# EasyEDA Pro project 步进电机天猛星转接板.eprj, schematic Schematic2
Board Name: Board2; Create Date: 2025-07-24; Page Name: P1; Project Name: 步进电机天空星转接板; Schematic Name: Schematic2; Update Date: 2025-07-24; Company: 嘉立创EDA; Page Size: A4; Version: V1.0
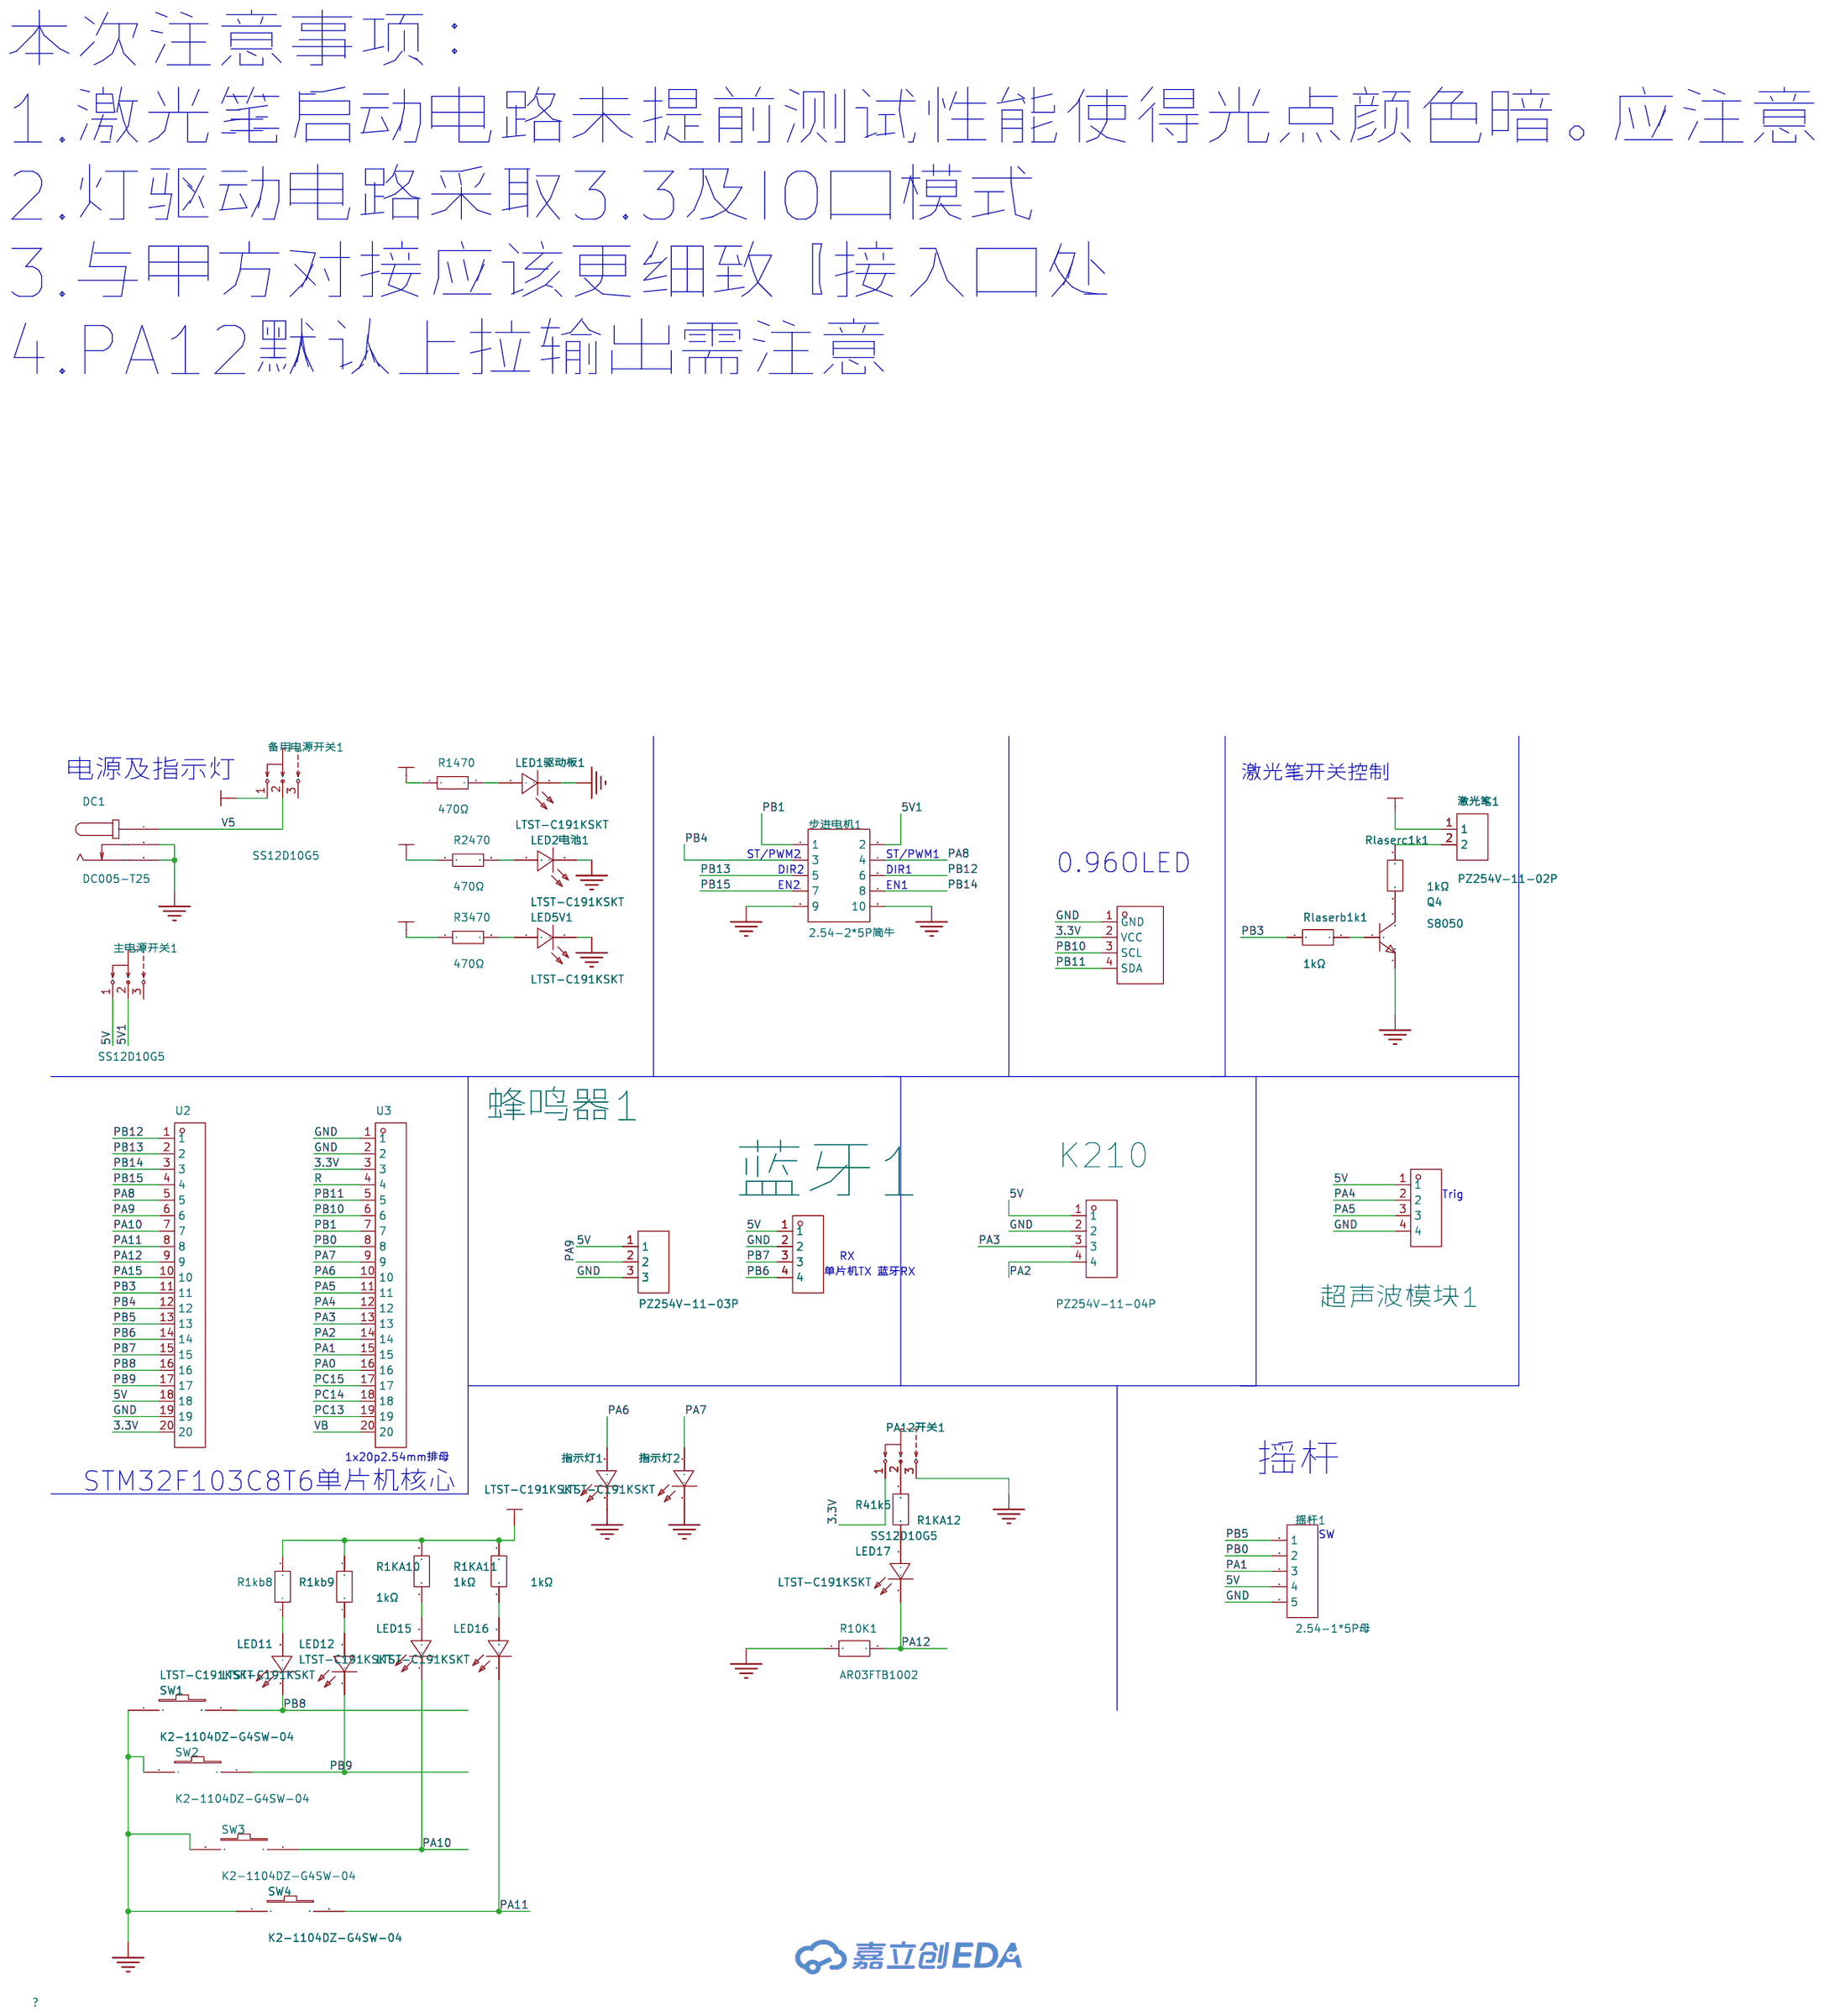
[diagram p1: schematic sheet]

## Parts
DC1  DC005-T25  [DC-IN-TH_DC-005-20A-1]
K210  PZ254V-11-04P  [HDR-TH_4P-P2.54-V-M]
LED1驱动板1  LTST-C191KSKT  [LED0603-RD-YELLOW]
LED2电池1  LTST-C191KSKT  [LED0603-RD-YELLOW]
LED5V1  LTST-C191KSKT  [LED0603-RD-YELLOW]
LED11  LTST-C191KSKT  [LED0603-RD-YELLOW]
LED12  LTST-C191KSKT  [LED0603-RD-YELLOW]
LED15  LTST-C191KSKT  [LED0603-RD-YELLOW]
LED16  LTST-C191KSKT  [LED0603-RD-YELLOW]
LED17  LTST-C191KSKT  [LED0603-RD-YELLOW]
OLED1  HS96L03W2C03  [OLED-TH_L27.8-W27.2-P2.54_C9900033791]
PA12开关1  SS12D10G5  [SW-TH_SHOU-HAN_SS12D10G4]
Q4  S8050  [SOT-23-3_L2.9-W1.6-P1.90-LS2.8-BR]
R1KA10  1kΩ  [R0603]
R1KA11  1kΩ  [R0603]
R1kb8  1kΩ  [R0603]
R1kb9  1kΩ  [R0603]
R10K1  AR03FTB1002  [R0603]
R41k5  1kΩ  [R0603]
R1470  470Ω  [R0603]
R2470  470Ω  [R0603]
R3470  470Ω  [R0603]
Rlaserb1k1  1kΩ  [R0603]
Rlaserc1k1  1kΩ  [R0603]
SW1  K2-1104DZ-G4SW-04  [KEY-TH_2P-L6.0-W6.0-P5.00]
SW2  K2-1104DZ-G4SW-04  [KEY-TH_2P-L6.0-W6.0-P5.00]
SW3  K2-1104DZ-G4SW-04  [KEY-TH_2P-L6.0-W6.0-P5.00]
SW4  K2-1104DZ-G4SW-04  [KEY-TH_2P-L6.0-W6.0-P5.00]
U2  KH-2FH-1X20P-H4.3  [hdr-th_20p-p2.54-v-f]
U3  KH-2FH-1X20P-H4.3  [hdr-th_20p-p2.54-v-f]
主电源开关1  SS12D10G5  [SW-TH_SHOU-HAN_SS12D10G4]
备用电源开关1  SS12D10G5  [SW-TH_SHOU-HAN_SS12D10G4]
指示灯1  LTST-C191KSKT  [LED0603-RD-YELLOW]
指示灯2  LTST-C191KSKT  [LED0603-RD-YELLOW]
摇杆1  2.54-1*5P母  [HDR-TH_5P-P2.54-V-F]
步进电机1  2.54-2*5P简牛  [IDC-TH_10P-P2.54_C5665]
激光笔1  PZ254V-11-02P  [HDR-TH_2P-P2.54-V-M]
蓝牙1  2.54-1*4P母  [HDR-TH_4P-P2.54-V-F]
蜂鸣器1  PZ254V-11-03P  [HDR-TH_3P-P2.54-V-M]
超声波模块1  KH-2.54FH-1X4P-H8.5  [HDR-TH_4P-P2.54-V-F]

## Library data of the parts
DC1 = DC005-T25: 触点内径:2.5mm;触点外径:6.3mm;额定电流:-;额定电压:-;; LCSC Part Name: 内径:2.5mm 外径:6.3mm; Supplier Part: C111573; Manufacturer: SOFNG(硕方); Supplier Footprint: 插件; JLCPCB Part Class: 扩展库; Datasheet: https://atta.szlcsc.com/upload/public/pdf/source/20211217/AAF92010038535095742900872F779AE.pdf; Supplier: LCSC; Inside Contact Diameter: 2.5mm; Outside Contact Diameter: 6.3mm
K210 = PZ254V-11-04P: 插针结构:1x4P;间距:2.54mm;行距:-;圆针/方针:方针;安装类型:直插;排数:单排;总PIN位数:4P;额定电流:3A;额定电压:250V;配合针长度:6mm;塑高:2.5mm;端接针长度:3mm;触头材质:-;工作温度范围:-40℃~+105℃;颜色:黑色;; LCSC Part Name: 间距:2.54mm 1x4P 直插 方针; Supplier Part: C2691448; Manufacturer: XFCN(兴飞); Supplier Footprint: 插件,P=2.54mm; JLCPCB Part Class: 扩展库; Datasheet: https://atta.szlcsc.com/upload/public/pdf/source/20200309/C492403_F9F19131791D08044AD4F84F8E751A34.pdf; Supplier: LCSC; Pin Structure: 1x4P; Pitch: 2.54mm; Circluar Pins/Square Pins: 方针; Mounting Type: 直插; Number of Rows: 单排; Number of Pins: 4P; Current Rating (Max): 3A; Voltage Rating (Max): 250V; Length of Mating Pin: 6mm; Insulation Height: 2.5mm; Length of End Connection Pin: 3mm; Operating Temperature Range: -40℃~+105℃; Color: 黑色
LED1驱动板1 LED2电池1 LED5V1 LED11 LED12 LED15-LED17 指示灯1 指示灯2 = LTST-C191KSKT: 发光颜色:黄色;正向电压(VF):2.1V;功率:75mW;正向电流:20mA;主波长:584.5nm~597nm;二极管配置:-;透镜颜色:无色透明透镜;色温:-;发光强度:104mcd;发光角度:130°;载带方式:-;工作温度:-55℃~+85℃;; LCSC Part Name: 黄灯; Supplier Part: C125100; Manufacturer: LITEON(光宝); Supplier Footprint: 0603; JLCPCB Part Class: 扩展库; Datasheet: https://atta.szlcsc.com/upload/public/pdf/source/20180129/C125100_15171877314981315871.pdf; Supplier: LCSC; Emitted Color: 黄色; Forward Voltage (VF): 2.1V; Power Dissipation: 75mW; Forward Current: 20mA; Dominant Wavelength: 584.5nm~597nm; Peak Wavelength: 588nm; Lens Color: 无色透明透镜; Luminous Intensity: 104mcd; Viewing Angle: 130°; Operating Temperature: -55℃~+85℃
OLED1 = HS96L03W2C03: 主控芯片:SSD1315;接口类型:I2C;尺寸(inch):0.96;像素分辨率:128x64;; LCSC Part Name: 0.96寸OLED显示屏窄白光IIC; Supplier Part: C5248080; Manufacturer: HS(汉昇); JLCPCB Part Class: 扩展库; Datasheet: https://atta.szlcsc.com/upload/public/pdf/source/20230627/763D01F79A90007632F098068C7C8AD9.pdf; Supplier: LCSC; Main Control Chip: SSD1315; Interface Type: I2C; Size: 0.96; Pixel Resolution: 128x64; Operating Temperature: -40℃~+70℃
PA12开关1 主电源开关1 备用电源开关1 = SS12D10G5: 电路结构:单刀双掷;安装方式:直插;额定电流(DC):2A;额定电压(DC):125V;机械寿命:3千次;; LCSC Part Name: 两档立式插件 3脚拨动开关 柄长5.0mm; Supplier Part: C7431054; Manufacturer: SHOU HAN(首韩); Supplier Footprint: 插件; JLCPCB Part Class: 扩展库; Datasheet: https://atta.szlcsc.com/upload/public/pdf/source/20231130/7A3DB6A149BF0A1DCFFE64FFC07FE434.pdf; Supplier: LCSC; Circuit: 单刀双掷; Switch Length: 12.7mm; Switch Width: 6.7mm; Mounting Style: 直插; Current Rating (DC): 2A; Voltage Rating (DC): 125V; Mechanical Life: 3千次; Operating Temperature: -25℃~+70℃
Q4 = S8050_C181158: 晶体管类型:NPN;集电极电流(Ic):500mA;集射极击穿电压(Vceo):25V;功率(Pd):300mW;; LCSC Part Name: NPN 电流:500mA 耐压:25V H档; Supplier Part: C181158; Manufacturer: Hottech(合科泰); Supplier Footprint: SOT-23; JLCPCB Part Class: 扩展库; Datasheet: https://atta.szlcsc.com/upload/public/pdf/source/20220506/D987F39D56F2975D34EC7947E75C4ABC.pdf; Supplier: LCSC; Transistor Type: NPN; Collector Current (Ic): 500mA; Collector-Emitter Breakdown Voltage (Vceo): 25V; Power Dissipation (Pd): 300mW; Transition Frequency (fT): 150MHz; Collector Cut-Off Current (Icbo): 100nA; Collector-Emitter Saturation Voltage (VCE(sat)@Ic,Ib): 600mV@500mA,50mA
R1KA10 R1KA11 R1kb8 R1kb9 R41k5 Rlaserb1k1 Rlaserc1k1 = FCR0603F1K: 电阻类型:厚膜电阻;阻值:1kΩ;精度:±1%;功率:100mW;最大工作电压:75V;; LCSC Part Name: 1K ±1%; Supplier Part: C5913168; Manufacturer: VO(翔胜); Supplier Footprint: 0603; JLCPCB Part Class: 扩展库; Datasheet: https://atta.szlcsc.com/upload/public/pdf/source/20230428/98B65D379E9BA4CF2A9223D1647B01B6.pdf; Supplier: LCSC; Type: 厚膜电阻; Tolerance: ±1%; Power(Watts): 100mW; Overload Voltage (Max): 75V; Operating Temperature Range: -55℃~+155℃
R10K1 = AR03FTB1002: LCSC Part Name: 0603 10K ±1% ±10PPM 1/16W; Supplier Part: C374599; Manufacturer: Viking(光颉); Supplier Footprint: 0603; JLCPCB Part Class: 扩展库; Datasheet: https://atta.szlcsc.com/upload/public/pdf/source/20220808/FEB8974641219B05EC1DF578AF1AC27C.pdf; Supplier: LCSC
R1470 R2470 R3470 = 0603WAF4700T5E: 电阻类型:厚膜电阻;阻值:470Ω;精度:±1%;功率:100mW;最大工作电压:75V;温度系数:±100ppm/℃;; LCSC Part Name: 470Ω ±1% 100mW 厚膜电阻; Supplier Part: C23179; Manufacturer: UNI-ROYAL(厚声); Supplier Footprint: 0603; JLCPCB Part Class: 基础库; Datasheet: https://atta.szlcsc.com/upload/public/pdf/source/20200306/C422600_1E6D84923E4A46A82E41ADD87F860B5C.pdf; Supplier: LCSC; Type: 厚膜电阻; Tolerance: ±1%; Power(Watts): 100mW; Overload Voltage (Max): 75V; Temperature Coefficient: ±100ppm/℃; Operating Temperature Range: -55℃~+155℃
SW1-SW4 = K2-1104DZ-G4SW-04: 作用力:250gf;安装方式:直插;开关长度:6mm;开关宽度:6mm;开关高度:7mm;触点电流:50mA;额定电压(DC):12V;绝缘电阻:100MΩ;机械寿命:10万次;; LCSC Part Name: 6*6*7 两脚长脚开关; Supplier Part: C961736; Manufacturer: 韩国韩荣; Supplier Footprint: 插件; JLCPCB Part Class: 扩展库; Datasheet: https://atta.szlcsc.com/upload/public/pdf/source/20201126/C961736_4F85C6E6E5B3656D5DC7C0B00D034F4A.pdf; Supplier: LCSC; Operating Force: 250gf; Mounting Style: 直插; Switch Length: 6mm; Switch Width: 6mm; Switch Height: 7mm; Contact Current: 50mA; Voltage Rating (DC): 12V; Insulation Resistance: 100MΩ; Mechanical Life: 10万次; Operating Temperature: -25℃~+85℃
U2 U3 = KH-2FH-1X20P-H4.3: 插孔结构:1x20P;间距:2mm;行距:-;圆孔/方孔:方孔;安装类型:直插;排数:单排;总孔位数:20P;额定电流:1.5A;额定电压:-;插孔方向:顶部;塑高:4.3mm;工作温度范围:-40℃~+105℃;; LCSC Part Name: 间距:2mm 1x20P 直插; Supplier Part: C2938439; Manufacturer: kinghelm(金航标); Supplier Footprint: 插件,P=2mm; JLCPCB Part Class: 扩展库; Datasheet: https://atta.szlcsc.com/upload/public/pdf/source/20211228/5EC70B7FC510D3D80A3799409C3607F1.pdf; Supplier: LCSC; Holes Structure: 1x20P; Pitch: 2mm; Circular Hole / Square Hole: 方孔; Mounting Type: 直插; Number of Rows: 单排; Number of Holes: 20P; Current Rating (Max): 1.5A; Holes Direction: 顶部; Insulation Height: 4.3mm; Operating Temperature Range: -40℃~+105℃
摇杆1 = 2.54-1*5P母: 插孔结构:1x5P;间距:2.54mm;行距:-;安装类型:直插;排数:单排;总孔位数:5P;塑高:-;触头材质:-;触头镀层:-;; LCSC Part Name: 间距:2.54mm 1x5P 直插; Supplier Part: C50950; Manufacturer: BOOMELE(博穆精密); Supplier Footprint: 插件,P=2.54mm; JLCPCB Part Class: 扩展库; Datasheet: https://atta.szlcsc.com/upload/public/pdf/source/20210301/C2718488_F4427B881E42CAA8DDB0B1C12B3A522C.pdf; Supplier: LCSC; Holes Structure: 1x5P; Pitch: 2.54mm; Mounting Type: 直插; Number of Rows: 单排; Number of Holes: 5P
步进电机1 = 2.54-2*5P简牛: 连接器类型:简牛座;间距:2.54mm;结构:2x5P;封装形式:直插;行距:2.54mm;排数:2;每排PIN数:5;触头材质:-;触头镀层:-;; LCSC Part Name: 2.54mm 2x5P 排数:2 每排P数:5; Supplier Part: C5665; Manufacturer: BOOMELE(博穆精密); Supplier Footprint: 插件,P=2.54mm; JLCPCB Part Class: 扩展库; Datasheet: https://atta.szlcsc.com/upload/public/pdf/source/20140331/1457707037896.pdf; Supplier: LCSC; Connector Type: 简牛座; Pitch: 2.54mm; Structure: 2x5P; Holder Type: 直插; Row Spacing: 2.54mm; Number of Rows: 2; Pin Number in each Row: 5
激光笔1 = PZ254V-11-02P: 插针结构:1x2P;间距:2.54mm;行距:-;圆针/方针:方针;安装方式:直插;排数:单排;总PIN位数:2P;额定电流:-;额定电压:-;配合针长度:6mm;塑高:2.5mm;端接针长度:3mm;触头材质:黄铜;触头镀层:-;工作温度:-40℃~+105℃;颜色:黑色;; LCSC Part Name: 1x2P 间距:2.54mm 方针 直插; Supplier Part: C492401; Manufacturer: XFCN(兴飞); Supplier Footprint: 插件,P=2.54mm; JLCPCB Part Class: 扩展库; Datasheet: https://atta.szlcsc.com/upload/public/pdf/source/20200309/C492401_A812433581A9B211A7FFA413ADDFF0E5.pdf; Supplier: LCSC; Pin Structure: 1x2P; Pitch: 2.54mm; Circluar Pins/Square Pins: 方针; Mounting Type: 直插; Number of Rows: 单排; Number of Pins: 2P; Length of Mating Pin: 6mm; Insulation Height: 2.5mm; Length of End Connection Pin: 3mm; Contact Material: 黄铜; Operating Temperature: -40℃~+105℃; Color: 黑色
蓝牙1 = 2.54-1*4P母: 插孔结构:1x4P;间距:2.54mm;行距:-;圆孔/方孔:方孔;安装类型:直插;排数:单排;总孔位数:4P;额定电流:3A;额定电压:-;插孔方向:顶部;塑高:-;触头材质:青铜;触头镀层:-;工作温度范围:-40℃~+105℃;焊接温度(最大值):-;; LCSC Part Name: 间距:2.54mm 1x4P 直插; Supplier Part: C2718488; Manufacturer: BOOMELE(博穆精密); Supplier Footprint: 插件,P=2.54mm; JLCPCB Part Class: 扩展库; Datasheet: https://atta.szlcsc.com/upload/public/pdf/source/20210301/C2718488_F4427B881E42CAA8DDB0B1C12B3A522C.pdf; Supplier: LCSC; Holes Structure: 1x4P; Pitch: 2.54mm; Circular Hole / Square Hole: 方孔; Mounting Type: 直插; Number of Rows: 单排; Number of Holes: 4P; Current Rating (Max): 3A; Holes Direction: 顶部; Contact Material: 青铜; Operating Temperature Range: -40℃~+105℃
蜂鸣器1 = PZ254V-11-03P: 插针结构:1x3P;间距:2.54mm;行距:-;圆针/方针:方针;安装方式:直插;排数:单排;总PIN位数:3P;额定电流:3A;额定电压:250V;配合针长度:6mm;塑高:2.5mm;端接针长度:3mm;工作温度:-40℃~+105℃;颜色:黑色;; LCSC Part Name: 1x3P 间距:2.54mm 方针 直插; Supplier Part: C2937625; Manufacturer: XFCN(兴飞); Supplier Footprint: 插件,P=2.54mm; JLCPCB Part Class: 扩展库; Datasheet: https://atta.szlcsc.com/upload/public/pdf/source/20200309/C492402_8335C3D49C4E4C618838D59BB1D024C1.pdf; Supplier: LCSC; Pin Structure: 1x3P; Pitch: 2.54mm; Circluar Pins/Square Pins: 方针; Mounting Type: 直插; Number of Rows: 单排; Number of Pins: 3P; Current Rating: 3A; Voltage Rating (Max): 250V; Length of Mating Pin: 6mm; Insulation Height: 2.5mm; Length of End Connection Pin: 3mm; Operating Temperature: -40℃~+105℃; Color: 黑色
超声波模块1 = KH-2.54FH-1X4P-H8.5: 插孔结构:1x4P;间距:2.54mm;行距:-;圆孔/方孔:方孔;安装类型:直插;排数:单排;总孔位数:4P;额定电流:3A;额定电压:-;插孔方向:顶部;塑高:8.5mm;工作温度范围:-40℃~+105℃;; LCSC Part Name: 间距:2.54mm 1x4P 直插; Supplier Part: C2905415; Manufacturer: kinghelm(金航标); Supplier Footprint: 插件,P=2.54mm; JLCPCB Part Class: 扩展库; Datasheet: https://atta.szlcsc.com/upload/public/pdf/source/20211019/F01742C8B89DCA4810A857CC894DA6D1.pdf; Supplier: LCSC; Holes Structure: 1x4P; Pitch: 2.54mm; Circular Hole / Square Hole: 方孔; Mounting Type: 直插; Number of Rows: 单排; Number of Holes: 4P; Current Rating (Max): 3A; Holes Direction: 顶部; Insulation Height: 8.5mm; Operating Temperature Range: -40℃~+105℃

## Nets
3.3V: OLED1.2(VCC) PA12开关1.1 R1KA10.2 R1KA11.2 R1kb8.2 R1kb9.2 U2.20 U3.3
5V: K210.1 R3470.1 U2.18 主电源开关1.1 备用电源开关1.1 摇杆1.4 激光笔1.1 蓝牙1.1 蜂鸣器1.1 超声波模块1.1
5V1: R1470.1 主电源开关1.2 步进电机1.2
GND: DC1.2 DC1.3 K210.2 LED1驱动板1.1(-) LED2电池1.1(-) LED5V1.1(-) OLED1.1(GND) PA12开关1.3 Q4.2 R10K1.1 SW1.1 SW2.1 SW3.1 SW4.1 U2.19 U3.1 U3.2 指示灯1.1(-) 指示灯2.1(-) 摇杆1.5 步进电机1.9 步进电机1.10 蓝牙1.2 蜂鸣器1.3 超声波模块1.4
V5: DC1.1 R2470.1 备用电源开关1.2
PA0: U3.16
PA1: U3.15 摇杆1.3
PA2: K210.4 U3.14
PA3: K210.3 U3.13
PA4: U3.12 超声波模块1.2
PA5: U3.11 超声波模块1.3
PA6: U3.10 指示灯1.2(+)
PA7: U3.9 指示灯2.2(+)
PA8: U2.5 步进电机1.4
PA9: U2.6 蜂鸣器1.2
PA10: LED15.1(-) SW3.2 U2.7
PA11: LED16.1(-) SW4.2 U2.8
PA12: LED17.1(-) R10K1.2 U2.9
PA15: U2.10
PB0: U3.8 摇杆1.2
PB1: U3.7 步进电机1.1
PB3: Rlaserb1k1.2 U2.11
PB4: U2.12 步进电机1.3
PB5: U2.13 摇杆1.1
PB6: U2.14 蓝牙1.4
PB7: U2.15 蓝牙1.3
PB8: LED11.1(-) SW1.2 U2.16
PB9: LED12.1(-) SW2.2 U2.17
PB10: OLED1.3(SCL) U3.6
PB11: OLED1.4(SDA) U3.5
PB12: U2.1 步进电机1.6
PB13: U2.2 步进电机1.5
PB14: U2.3 步进电机1.8
PB15: U2.4 步进电机1.7
PC13: U3.19
PC14: U3.18
PC15: U3.17
R: U3.4
VB: U3.20
$1N2098: LED1驱动板1.2(+) R1470.2
$1N2102: LED5V1.2(+) R3470.2
$1N6603: LED17.2(+) R41k5.1
Net-(LED2电池1-2): LED2电池1.2(+) R2470.2
Net-(LED11-2): LED11.2(+) R1kb8.1
Net-(LED12-2): LED12.2(+) R1kb9.1
Net-(LED15-2): LED15.2(+) R1KA10.1
Net-(LED16-2): LED16.2(+) R1KA11.1
Net-(PA12开关1-2): PA12开关1.2 R41k5.2
Net-(Q4-1): Q4.1 Rlaserb1k1.1
Net-(Q4-3): Q4.3 Rlaserc1k1.1
Net-(Rlaserc1k1-2): Rlaserc1k1.2 激光笔1.2

Not connected (* = marked no-connect by the designer): 主电源开关1 3; 备用电源开关1 3

## Notes on the sheet
- 本次注意事项：
  1.激光笔启动电路未提前测试性能使得光点颜色暗。应注意
  2.灯驱动电路采取3.3及IO口模式
  3.与甲方对接应该更细致【接入口处
  4.PA12默认上拉输出需注意
- 电源及指示灯
- 激光笔开关控制
- ST/PWM2
- DIR2
- DIR1
- ST/PWM1
- 0.96OLED
- EN2
- EN1
- Trig
- 单片机TX 蓝牙RX
- RX
- 1x20p2.54mm排母
- 摇杆
- STM32F103C8T6单片机核心
- SW
